# Altium schematic sheet ProportionalSolenoid.SchDoc
size A4
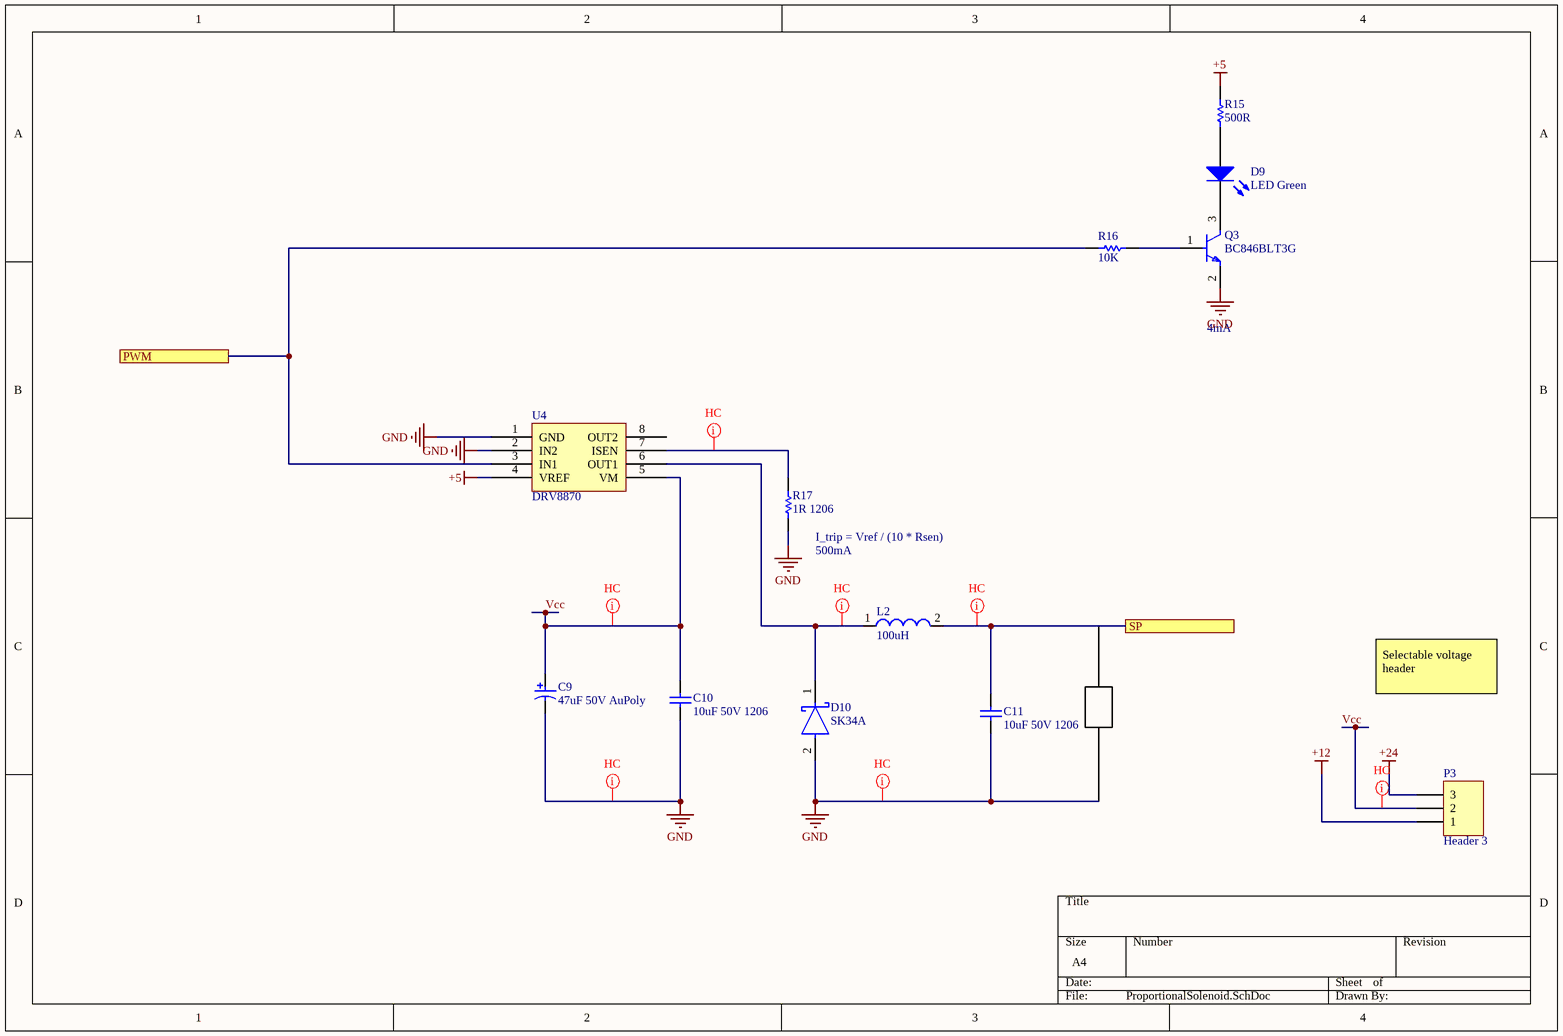
[diagram p0: ProportionalSolenoid.SchDoc]

## Parts
C9  47uF 50V AuPoly  [EEH-ZA1H220P]
C10  10uF 50V 1206  [CAPC1206(3216)190_N]
C11  10uF 50V 1206  [CAPC1206(3216)190_N]
D9  LED Green  [0603_A]
D10  SK34A  [FP-DO-214AC-MFG]
L2  100uH  [L0404]
P3  Header 3  [HDR1X3]
Q3  BC846BLT3G  [FP-318-08-IPC_C]
R15  500R  [RESC0603(1608)_L]
R16  10K  [RESC0603(1608)_N]
R17  1R 1206  [RESC1206(3216)_N]
U4  DRV8870  [SOIC127P600X170_HS-9N]

## Ports
PWM, SP

## Nets
+5: R15.2 U4.4(VREF)
+12: P3.1
+24: P3.3
GND: C9.2 C10.1 C11.1 D10.2(A) Q3.2(E) R17.1 U4.1(GND) U4.2(IN2)
PWM: R16.1 U4.3(IN1) ; port PWM
SP: C11.2 L2.2 ; port SP
Vcc: C9.1 C10.2 P3.2 U4.5(VM)
NetD9_1: D9.1(K) Q3.3(C)
NetD9_2: D9.2(A) R15.1
NetD10_1: D10.1(C) L2.1 U4.6(OUT1)
NetQ3_1: Q3.1(B) R16.2
NetR17_2: R17.2 U4.7(ISEN)

Not connected (* = marked no-connect by the designer): U4 8(OUT2)

## Layout directives
net class HC: GND, NetD10_1, NetR17_2, SP, Vcc

## Notes on the sheet
- 4mA
- (near R17) I_trip = Vref / (10 * Rsen)
- (near R17) 500mA
- Selectable voltage header

## Library data of the parts
C9 = C-Poly: Manufacturer: AVX; DELETED: Compliant; Product Depth (mm): 4.3mm; Product Length (mm): 7.3mm; Case Style: Molded; Product Diameter (mm): NotRequiredmm; DF: 6%; Seal: NotRequired; Capacitance: 22000000pF; Product Height (mm): 2.9mm; Rad Hardened: No; ESR: 0.2ohm; Polarity: Polar; DCL: 5.5uA; Voltage: 25VDC; Tolerance (+ or -): 10%; Construction: SMTChip; Mounting Style: SurfaceMount; Packaging: TapeandReel; Case Code: D; Package Reference: 7343-31; Manufacturer URL: http://www.avx.com/; Failure Rate: NotRequired; Insulation: NotRequired; Operating Temp Range: -55Cto125C; Mounting Technology: SurfaceMount; Package Description: 2-Pin Surface Mount Device, Body 7.3 x 4.35 mm; Length W/Weld (max): NotRequiredmm; Lead Spacing (nom): NotRequiredmm; Seated Plane Height: NotRequiredmm; Wire Form: NotRequired; Datasheet Version: 02/2004; Datasheet URL: https://datasheet.ciiva.com/11793/0900766b80066cb4-11793194.pdf; Length W/Weld: NotRequiredmm; Package / Case: 7343-31
C10 C11 = CMP-1037-04983-1: CAP 10uF 50V ±20% 1206 (3216 Metric) Thickness 1.9mm SMD; Tolerance: Â±20%; Case-Metric: 3216; Case-EIA: 1206; Technology: SMT; Max Thickness: 1.9 mm; Rated Voltage: 50 V; Value: 10uF
D9 = CMP-1426-00002-1: SMD mono-color Chip LED, WL-SMCW, Green; PartNumber: 150060GS75000; Manufacturer: Wuerth Elektronik; ComponentLink1URL: http://www.we-online.com; ComponentLink2Description: Datasheet; Color: Green; ComponentLink2URL: http://katalog.we-online.com/led/datasheet/150060GS75000.pdf; PackageReference: 0603_A; ComponentLink1Description: Manufacturer URL
D10 = CMP-56206-000004-1: DIODE SCHOTTKY 5A 30V SMA; Mount: Surface Mount; Max Reverse Voltage (DC): 30V; Case/Package: SMA; Packaging: Tape and Reel; Average Rectified Current: 5A
L2 = Inductor0404: Manufacturer: Wuerth Elektronik; PartNumber: 74479763215; Inductance: 1.50 ÂµH; ComponentLink1Description: Manufacturer URL; PackageReference: SMD 0603_A; ComponentLink1URL: http://www.we-online.com; ComponentLink2URL: http://katalog.we-online.de/kataloge/eisos/media/pdf/74479763215.pdf; ComponentLink2Description: Datasheet
P3 = Header 3: Header, 3-Pin; LatestRevisionDate: 17-Jul-2002; LatestRevisionNote: Re-released for DXP Platform.; Publisher: Altium Limited
Q3 = CMP-07170-000022-1: TRANS NPN 65V 0.1A SOT-23; Number of Elements: 1; Collector Emitter Saturation Voltage: 600mV; Power Dissipation: 300mW; hFE Min: 200; Transition Frequency: 100MHz; Max Collector Current: 100mA; Collector Base Voltage (VCBO): 80V; Emitter Base Voltage (VEBO): 6V; Element Configuration: Single; REACH SVHC: No SVHC; Length: 2.9mm; Polarity: NPN; Max Breakdown Voltage: 65V; Case/Package: SOT-23-3; Max Operating Temperature: 150°C; Min Operating Temperature: -55°C; Voltage Rating (DC): 65V; Number of Pins: 3; Radiation Hardening: No; Package Quantity: 1; Contact Plating: Tin; Max Frequency: 100MHz; Width: 1.3mm; Max Power Dissipation: 300mW; Height: 1mm; Lead Free: Lead Free; Frequency: 100MHz; Halogen Free: Halogen Free; Collector Emitter Voltage (VCEO): 65V; Gain Bandwidth Product: 100MHz; Current Rating: 100mA; Collector Emitter Breakdown Voltage: 65V; Packaging: Tape and Reel
R15 = CMP-1012-00067-1: 510R 0.1W 5% 0603 (1608 Metric)  SMD; Case-EIA: 0603; Value: 510.00 Ohm; Case-Metric: 1608; Technology: SMT; Power: 0.1 W; Tolerance: 5 %
R16 = CMP-1012-00623-1: 10K 0.1W 1% 0603 (1608 Metric)  SMD; Value: 10000.00 Ohm; Case-EIA: 0603; Case-Metric: 1608; Power: 0.1 W; Tolerance: 1 %; Technology: SMT
R17 = CMP-1014-00004-1: 1R2 0.25W 5% 1206 (3216 Metric)  SMD; Value: 1.20 Ohm; Case-Metric: 3216; Case-EIA: 1206; Power: 0.25 W; Technology: SMT; Tolerance: 5 %